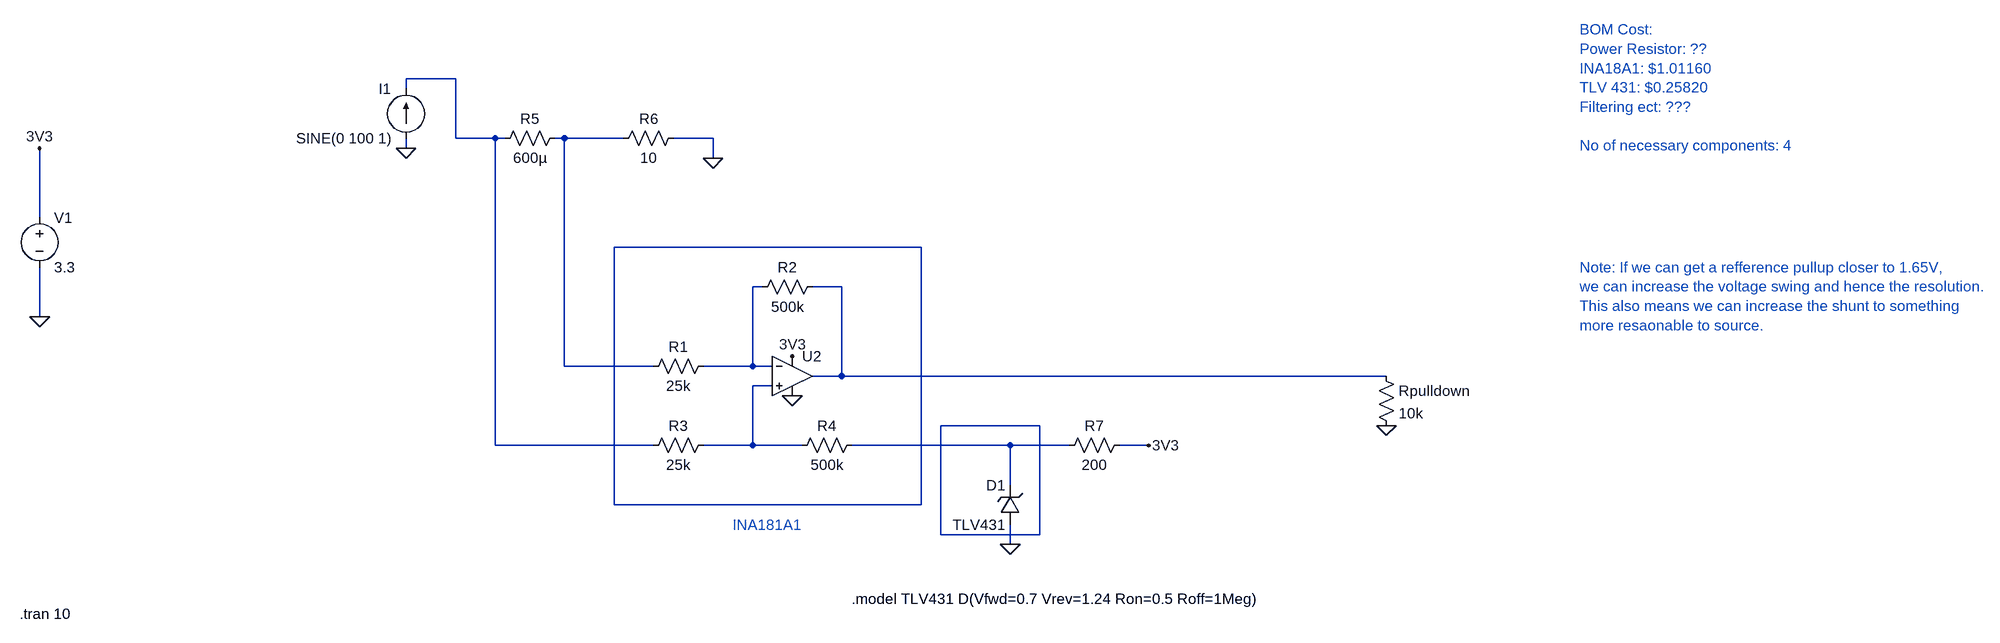
[diagram p0: schematic INA181 Basic Current Sense.asc]
INA181 Basic Current Sense.asc, the LTspice schematic file:
Version 4.1
SHEET 1 2224 680
WIRE -304 -384 -384 -384
WIRE -384 -368 -384 -384
WIRE -304 -288 -304 -384
WIRE -240 -288 -304 -288
WIRE -224 -288 -240 -288
WIRE -128 -288 -144 -288
WIRE -32 -288 -128 -288
WIRE 112 -288 48 -288
WIRE -384 -272 -384 -288
WIRE 112 -256 112 -288
WIRE -976 -160 -976 -272
WIRE 448 -112 -48 -112
WIRE 192 -48 176 -48
WIRE 320 -48 272 -48
WIRE -976 0 -976 -80
WIRE -128 80 -128 -288
WIRE 16 80 -128 80
WIRE 176 80 176 -48
WIRE 176 80 96 80
WIRE 208 80 176 80
WIRE 320 96 320 -48
WIRE 320 96 272 96
WIRE 1200 96 320 96
WIRE 208 112 176 112
WIRE 640 176 480 176
WIRE -240 208 -240 -288
WIRE 16 208 -240 208
WIRE 176 208 176 112
WIRE 176 208 96 208
WIRE 256 208 176 208
WIRE 592 208 336 208
WIRE 688 208 592 208
WIRE 816 208 768 208
WIRE 592 272 592 208
WIRE -48 304 -48 -112
WIRE 448 304 448 -112
WIRE 448 304 -48 304
WIRE 480 352 480 176
WIRE 640 352 640 176
WIRE 640 352 480 352
WIRE 592 368 592 336
FLAG 112 -256 0
FLAG -384 -272 0
FLAG -976 0 0
FLAG -976 -272 3V3
FLAG 240 128 0
FLAG 240 64 3V3
FLAG 592 368 0
FLAG 816 208 3V3
FLAG 1200 176 0
SYMBOL res 112 64 R90
WINDOW 0 0 56 VBottom 2
WINDOW 3 32 56 VTop 2
SYMATTR InstName R1
SYMATTR Value 25k
SYMBOL res 288 -64 R90
WINDOW 0 0 56 VBottom 2
WINDOW 3 32 56 VTop 2
SYMATTR InstName R2
SYMATTR Value 500k
SYMBOL res 112 192 R90
WINDOW 0 0 56 VBottom 2
WINDOW 3 32 56 VTop 2
SYMATTR InstName R3
SYMATTR Value 25k
SYMBOL res 352 192 R90
WINDOW 0 0 56 VBottom 2
WINDOW 3 32 56 VTop 2
SYMATTR InstName R4
SYMATTR Value 500k
SYMBOL res -128 -304 R90
WINDOW 0 0 56 VBottom 2
WINDOW 3 32 56 VTop 2
SYMATTR InstName R5
SYMATTR Value 600µ
SYMBOL res 64 -304 R90
WINDOW 0 0 56 VBottom 2
WINDOW 3 32 56 VTop 2
SYMATTR InstName R6
SYMATTR Value 10
SYMBOL voltage -976 -176 R0
WINDOW 123 0 0 Left 0
WINDOW 39 0 0 Left 0
SYMATTR InstName V1
SYMATTR Value 3.3
SYMBOL zener 608 336 R180
WINDOW 0 24 64 Left 2
WINDOW 3 24 0 Left 2
SYMATTR InstName D1
SYMATTR Value TLV431
SYMBOL res 784 192 R90
WINDOW 0 0 56 VBottom 2
WINDOW 3 32 56 VTop 2
SYMATTR InstName R7
SYMATTR Value 200
SYMBOL OpAmps\\UniversalOpAmp2 240 96 R0
SYMATTR InstName U2
SYMBOL current -384 -288 R180
WINDOW 0 24 80 Left 2
WINDOW 3 24 0 Left 2
WINDOW 123 0 0 Left 0
WINDOW 39 0 0 Left 0
SYMATTR InstName I1
SYMATTR Value SINE(0 100 1)
SYMBOL res 1184 80 R0
SYMATTR InstName Rpulldown
SYMATTR Value 10k
TEXT 336 456 Left 2 !.model TLV431 D(Vfwd=0.7 Vrev=1.24 Ron=0.5 Roff=1Meg)
TEXT -1008 480 Left 2 !.tran 10
TEXT 144 336 Left 2 ;INA181A1
TEXT 1512 -464 Left 2 ;BOM Cost:\nPower Resistor: ??\nINA18A1: $1.01160\nTLV 431: $0.25820\nFiltering ect: ???\n \nNo of necessary components: 4
TEXT 1512 -80 Left 2 ;Note: If we can get a refference pullup closer to 1.65V,\nwe can increase the voltage swing and hence the resolution.\nThis also means we can increase the shunt to something\nmore resaonable to source.

The netlist it stands for:
* INA181 Basic Current Sense.asc
R1 N004 N002 25k
R2 N005 N004 500k
R3 N006 N001 25k
R4 N008 N006 500k
R5 N002 N001 600µ
R6 0 N002 10
V1 3V3 0 3.3
D1 0 N008 TLV431
R7 3V3 N008 200
X§U2 N006 N004 3V3 0 N005 level2 Avol=1Meg GBW=10Meg Slew=10Meg Ilimit=25m Rail=0 Vos=0 En=0 Enk=0 In=0 Ink=0 Rin=500Meg  ; pins In+ In- V+ V- OUT
I1 0 N001 SINE(0 100 1)
Rpulldown N005 0 10k
.model D D
.lib standard.dio
.model TLV431 D(Vfwd=0.7 Vrev=1.24 Ron=0.5 Roff=1Meg)
.tran 10
* INA181A1
* BOM Cost:
* Power Resistor: ??
* INA18A1: $1.01160
* TLV 431: $0.25820
* Filtering ect: ???
* No of necessary components: 4
* Note: If we can get a refference pullup closer to 1.65V,
* we can increase the voltage swing and hence the resolution.
* This also means we can increase the shunt to something
* more resaonable to source.
.lib UniversalOpAmp2.lib
.backanno
.end